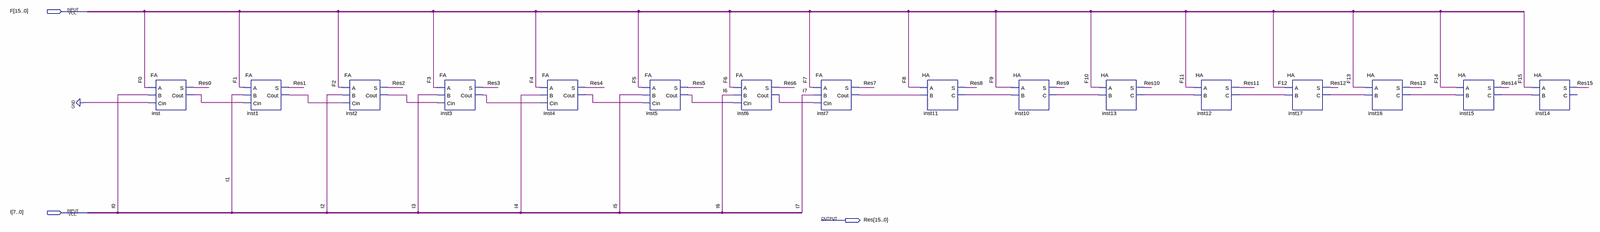
[diagram p0: schematic sheet, whole]
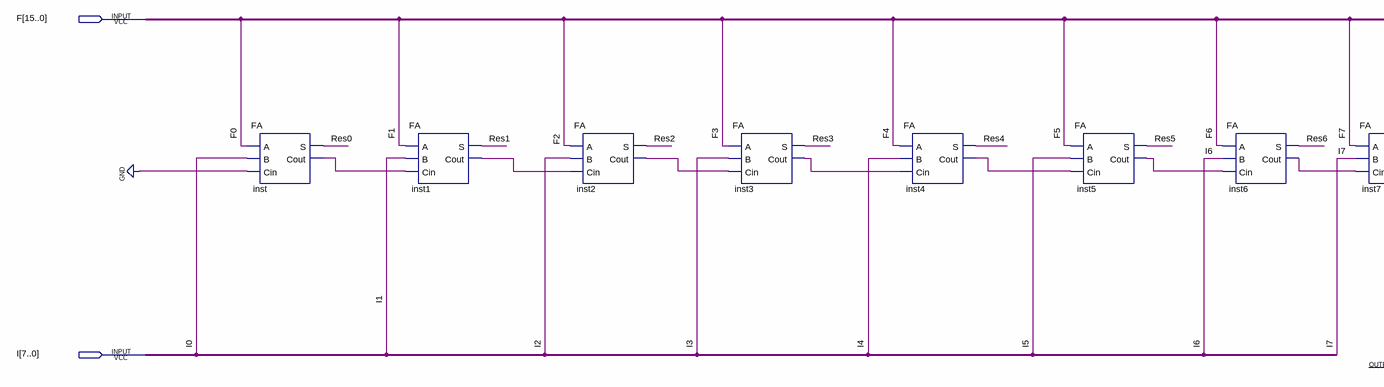
[diagram p1: schematic sheet, left part]
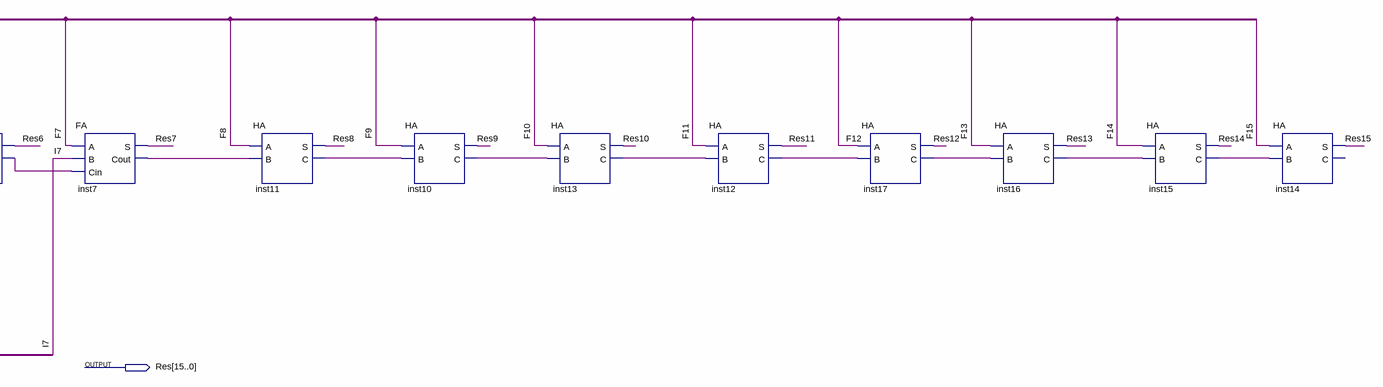
[diagram p2: schematic sheet, right part]
// Quartus schematic 16bitAdder.bdf as structural Verilog: 16 symbols, 3 pins
module \16bitAdder  (
  input  [15:0] F,
  input  [7:0] I,
  output [15:0] Res
);

  wire inst1_cout, inst2_cout, inst3_cout, inst4_cout, inst5_cout, inst6_cout, inst7_cout, inst10_c,
       inst11_c, inst12_c, inst13_c, inst15_c, inst16_c, inst17_c, inst_cout;

  FA inst (.A(F[0]), .B(I[0]), .Cin(1'b0), .S(Res[0]), .Cout(inst_cout));
  FA inst1 (.A(F[1]), .B(I[1]), .Cin(inst_cout), .S(Res[1]), .Cout(inst1_cout));
  FA inst2 (.A(F[2]), .B(I[2]), .Cin(inst1_cout), .S(Res[2]), .Cout(inst2_cout));
  FA inst3 (.A(F[3]), .B(I[3]), .Cin(inst2_cout), .S(Res[3]), .Cout(inst3_cout));
  FA inst4 (.A(F[4]), .B(I[4]), .Cin(inst3_cout), .S(Res[4]), .Cout(inst4_cout));
  FA inst5 (.A(F[5]), .B(I[5]), .Cin(inst4_cout), .S(Res[5]), .Cout(inst5_cout));
  FA inst6 (.A(F[6]), .B(I[6]), .Cin(inst5_cout), .S(Res[6]), .Cout(inst6_cout));
  FA inst7 (.A(F[7]), .B(I[7]), .Cin(inst6_cout), .S(Res[7]), .Cout(inst7_cout));
  HA inst11 (.A(F[8]), .B(inst7_cout), .S(Res[8]), .C(inst11_c));
  HA inst10 (.A(F[9]), .B(inst11_c), .S(Res[9]), .C(inst10_c));
  HA inst13 (.A(F[10]), .B(inst10_c), .S(Res[10]), .C(inst13_c));
  HA inst12 (.A(F[11]), .B(inst13_c), .S(Res[11]), .C(inst12_c));
  HA inst17 (.A(F[12]), .B(inst12_c), .S(Res[12]), .C(inst17_c));
  HA inst16 (.A(F[13]), .B(inst17_c), .S(Res[13]), .C(inst16_c));
  HA inst15 (.A(F[14]), .B(inst16_c), .S(Res[14]), .C(inst15_c));
  HA inst14 (.A(F[15]), .B(inst15_c), .S(Res[15]));  // open: C
endmodule
